# EAGLE design snopf (EAGLE 9.6.1)
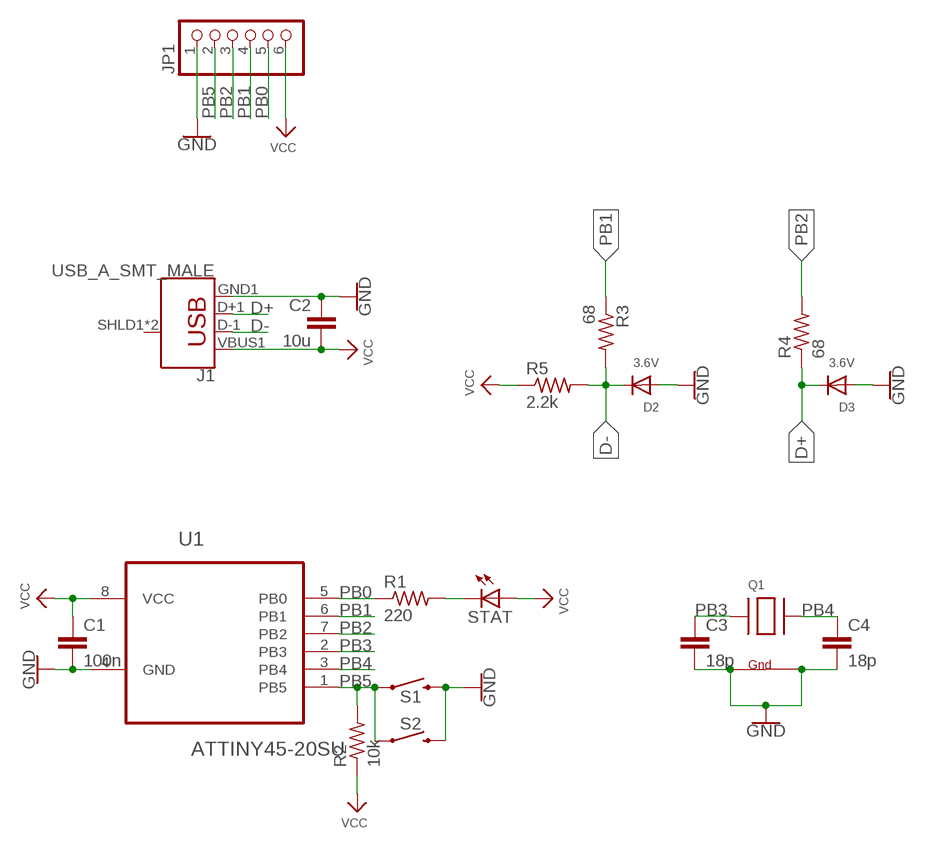
[diagram p0: schematic, sheet 1]

## Parts
C1  100n  C-EUC0603  [C0603]
C2  10u  C-EUC0603  [C0603]
C3  18p  C-EUC0603  [C0603]
C4  18p  C-EUC0603  [C0603]
D2  3.6V  DIODESOD-123  [SOD-123]
D3  3.6V  DIODESOD-123  [SOD-123]
J1  USB_A_SMT_MALE  [USB-A-SMT-MALE]
JP1  PINHD-1X6CLEAN  [1X06-CLEAN]
Q1  XTAL-4-3225  [NX3225]
R1  220  R-US_R0603  [R0603]
R2  10k  R-US_R0603  [R0603]
R3  68  R-US_R0603  [R0603]
R4  68  R-US_R0603  [R0603]
R5  2.2k  R-US_R0603  [R0603]
S1  MOMENTARY-SWITCH-SPST-SMD-12MM  [TACTILE_SWITCH_SMD_12MM]
S2  MOMENTARY-SWITCH-SPST-SMD-5.2-REDUNDANT  [TACTILE_SWITCH_SMD_5.2MM]
STAT  LEDCHIPLED_0603  [CHIPLED_0603]
U1  ATTINY45-20SU  [SOIC127P798X216-8N]

## Nets
D+: D3.C J1.D+1(D+) R4.1
D-: D2.C J1.D-1(D-) R3.2 R5.2
GND: C1.2 C2.1 C3.2 C4.2 D2.A D3.A J1.GND1(GND) JP1.1 Q1.2(G2) Q1.4(G1) S1.3 S2.3 S2.4 U1.4(GND)
N$2: R1.2 STAT.C
PB0: JP1.5 R1.1 U1.5(PB0)
PB1: JP1.4 R3.1 U1.6(PB1)
PB2: JP1.3 R4.2 U1.7(PB2)
PB3: C3.1 Q1.1(X1) U1.2(PB3)
PB4: C4.1 Q1.3(X2) U1.3(PB4)
PB5: JP1.2 R2.2 S1.1 S2.1 S2.2 U1.1(PB5)
VCC: C1.1 C2.2 J1.VBUS1(VBUS) JP1.6 R2.1 R5.1 STAT.A U1.8(VCC)
Unconnected: J1.SHLD1(SHIELD) J1.SHLD2(SHIELD)

## Library data of the parts
C1-C4 = resistor:C-EU: CAPACITOR, European symbol
D2 D3 = adafruit:DIODE: Diode SMADIODE - SMA Surface Mount Package 20V 1A Schottky Diode Digikey: 641-1014-6-ND DO-1N4148 - Through Hole Small Current Diode SOD-123 20V 1 A (.5mV Vf) Schottky Diode - Digikey: MBRX120TPMSCT-ND SOD-323 10V 570mA (.38mV Vf, 3ns) Schottky Diode - Digikey: ZLLS410CT-ND SOD-523 30V 30mA Schottky Diode (RB751S-40TE61) - Digikey: RB751S-40TE61CT-ND SOT23-R/W - SOT23 Package (R = Solder Paste/Reflow Ovens, W = Hand-Soldering) BAT54Film 40V 300mA - Digikey: 497-7162-1-ND
J1 = SparkFun-Connectors:USB_A: USB-A Connector Male and female variants, as well as PTH and SMT variants SparkFun Products: SparkFun XBee Explorer Dongle <https://www.sparkfun.com/products/11697> PTH Male SparkFun MicroView-USB Programmer <https://www.sparkfun.com/products/12924> SMT Male SparkFun USB Type A Female Breakout <https://www.sparkfun.com/products/12700> SMT Female; PROD_ID: CONN-11499
JP1 = adafruit:PINHD-1X6: PIN HEADER
Q1 = adafruit:XTAL-4: Classic 4-pin 3.2 x 2.5mm crystal
R1-R5 = resistor:R-US_: RESISTOR, American symbol
S1 = SparkFun-Switches:MOMENTARY-SWITCH-SPST: Momentary Switch (Pushbutton) - SPST Normally-open (NO) SPST momentary switches (buttons, pushbuttons). Variants PTH-12MM - 12mm square, through-hole Momentary Pushbutton Switch - 12mm Square <https://www.sparkfun.com/products/9190> (COM-09190) PTH-6.0MM, PTH-6.0MM-KIT - 6.0mm square, through-hole Mini Pushbutton Switch <https://www.sparkfun.com/products/97> (COM-00097) KIT package intended for soldering kit's - only one side of pads' copper is exposed. PTH-RIGHT-ANGLE-KIT - Right-angle, through-hole Right Angle Tactile Button <https://www.sparkfun.com/products/10791> - Used on SparkFun BigTime Watch Kit <https://www.sparkfun.com/products/11734> SMD-12MM - 12mm square, surface-mount Tactile Button - SMD (12mm) <https://www.sparkfun.com/products/12993> (COM-12993) Used on SparkFun PicoBoard <https://www.sparkfun.com/products/11888> SMD-4.5MM - 4.5mm Square Trackball Switch Used on SparkFun Blackberry Trackballer Breakout <https://www.sparkfun.com/products/13169> SMD-4.6MMX2.8MM - 4.60mm x 2.80mm, surface mount Used on SparkFun SAMD21 Mini Breakout <https://www.sparkfun.com/products/13664> SMD-5.2MM, SMD-5.2-REDUNDANT - 5.2mm square, surface-mount Mini Pushbutton Switch - SMD <https://www.sparkfun.com/products/8720> (COM-08720) Used on Arduino Pro Mini <https://www.sparkfun.com/products/11114> REDUNDANT package connects both switch circuits together SMD-6.0X3.5MM - 6.0 x 3.5mm, surface mount Momentary Reset Switch SMD <https://www.sparkfun.com/products/8229> (COM-08229) SMD-6.2MM-TALL - 6.2mm square, surface mount Tactile Button - SMD (6mm) <https://www.sparkfun.com/products/12992> Used on SparkFun Digital Sandbox <https://www.sparkfun.com/products/12651> SMD-RIGHT-ANGLE - Right-angle, surface mount Used on SparkFun Block for Intel® Edison - Arduino <https://www.sparkfun.com/products/13036>; PROD_ID: SWCH-11967; SF_SKU: COM-12993
S2 = SparkFun-Switches:MOMENTARY-SWITCH-SPST: Momentary Switch (Pushbutton) - SPST Normally-open (NO) SPST momentary switches (buttons, pushbuttons). Variants PTH-12MM - 12mm square, through-hole Momentary Pushbutton Switch - 12mm Square <https://www.sparkfun.com/products/9190> (COM-09190) PTH-6.0MM, PTH-6.0MM-KIT - 6.0mm square, through-hole Mini Pushbutton Switch <https://www.sparkfun.com/products/97> (COM-00097) KIT package intended for soldering kit's - only one side of pads' copper is exposed. PTH-RIGHT-ANGLE-KIT - Right-angle, through-hole Right Angle Tactile Button <https://www.sparkfun.com/products/10791> - Used on SparkFun BigTime Watch Kit <https://www.sparkfun.com/products/11734> SMD-12MM - 12mm square, surface-mount Tactile Button - SMD (12mm) <https://www.sparkfun.com/products/12993> (COM-12993) Used on SparkFun PicoBoard <https://www.sparkfun.com/products/11888> SMD-4.5MM - 4.5mm Square Trackball Switch Used on SparkFun Blackberry Trackballer Breakout <https://www.sparkfun.com/products/13169> SMD-4.6MMX2.8MM - 4.60mm x 2.80mm, surface mount Used on SparkFun SAMD21 Mini Breakout <https://www.sparkfun.com/products/13664> SMD-5.2MM, SMD-5.2-REDUNDANT - 5.2mm square, surface-mount Mini Pushbutton Switch - SMD <https://www.sparkfun.com/products/8720> (COM-08720) Used on Arduino Pro Mini <https://www.sparkfun.com/products/11114> REDUNDANT package connects both switch circuits together SMD-6.0X3.5MM - 6.0 x 3.5mm, surface mount Momentary Reset Switch SMD <https://www.sparkfun.com/products/8229> (COM-08229) SMD-6.2MM-TALL - 6.2mm square, surface mount Tactile Button - SMD (6mm) <https://www.sparkfun.com/products/12992> Used on SparkFun Digital Sandbox <https://www.sparkfun.com/products/12651> SMD-RIGHT-ANGLE - Right-angle, surface mount Used on SparkFun Block for Intel® Edison - Arduino <https://www.sparkfun.com/products/13036>; PROD_ID: SWCH-08247; SF_SKU: COM-08720
STAT = adafruit:LED: LED OSRAM: - CHIPLED LG R971, LG N971, LY N971, LG Q971, LY Q971, LO R971, LY R971 LH N974, LH R974 LS Q976, LO Q976, LY Q976 LO Q996 - Hyper CHIPLED LW Q18S LB Q993, LB Q99A, LB R99A - SideLED LS A670, LO A670, LY A670, LG A670, LP A670 LB A673, LV A673, LT A673, LW A673 LH A674 LY A675 LS A676, LA A676, LO A676, LY A676, LW A676 LS A679, LY A679, LG A679 - Hyper Micro SIDELED® LS Y876, LA Y876, LO Y876, LY Y876 LT Y87S - SmartLED LW L88C, LW L88S LB L89C, LB L89S, LG L890 LS L89K, LO L89K, LY L89K LS L896, LA L896, LO L896, LY L896 - TOPLED LS T670, LO T670, LY T670, LG T670, LP T670 LSG T670, LSP T670, LSY T670, LOP T670, LYG T670 LG T671, LOG T671, LSG T671 LB T673, LV T673, LT T673, LW T673 LH T674 LS T676, LA T676, LO T676, LY T676, LB T676, LH T676, LSB T676, LW T676 LB T67C, LV T67C, LT T67C, LS T67K, LO T67K, LY T67K, LW E67C LS E67B, LA E67B, LO E67B, LY E67B, LB E67C, LV E67C, LT E67C LW T67C LS T679, LY T679, LG T679 LS T770, LO T770, LY T770, LG T770, LP T770 LB T773, LV T773, LT T773, LW T773 LH T774 LS E675, LA E675, LY E675, LS T675 LS T776, LA T776, LO T776, LY T776, LB T776 LHGB T686 LT T68C, LB T68C - Hyper Mini TOPLED® LB M676 - Mini TOPLED Santana® LG M470 LS M47K, LO M47K, LY M47K Source: http://www.osram.convergy.de/
U1 = ATTINY45-20SU:ATTINY45-20SU: 8-bit Microcontroller with 4 Bytes In-System Programmable Flash; AVAILABILITY: Unavailable; DESCRIPTION: ATtiny Series 20 MHz 4 KB Flash 256 B SRAM 8-Bit Microcontroller - SOIC-8; MF: Microchip; MP: ATTINY45-20SU; PACKAGE: SOIC-8 Microchip; PRICE: None

## Board
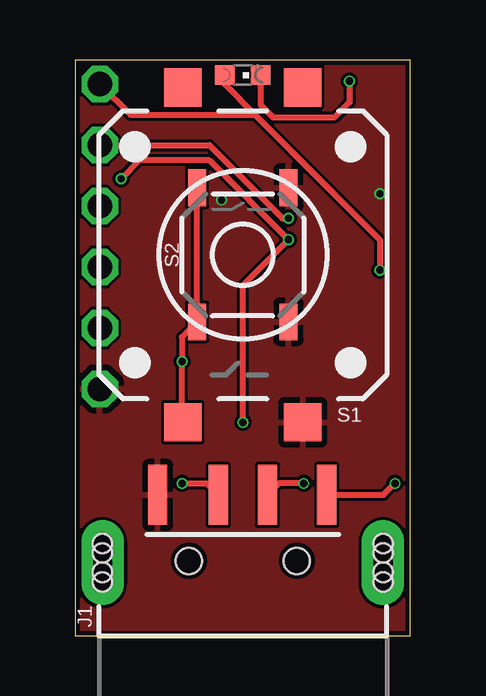
[diagram p1: board, top side]
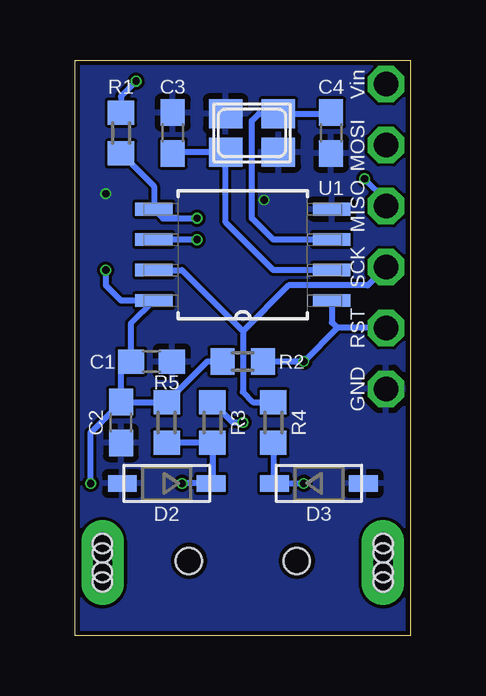
[diagram p2: board, bottom side, seen from below]

Size 13.97 x 23.99 mm. Coordinates in mm from the lower left corner, seen from the top.
Outline: 0,0 13.97,0 13.97,23.99 0,23.99 0,0
Copper layers (1*16): Top 0.035mm / dielectric 1.5mm / Bottom 0.035mm
Design rules "jlcpcb": minimum track width 3.5mil, minimum drill 0.2mm, track to track 5mil, track to pad 5mil, pad to pad 5mil, via to via 5mil, smd to smd 5mil, copper to edge 0.2mm, drill to drill 0.4mm, minimum pad ring 3mil, minimum via ring 3mil, stop-mask expansion 4mil, vias tented up to drill 35mil, thermal gap 10mil

### Footprints (pad centres in the part's own frame; a part is rotated, then mirrored left to right if it is on the bottom)
C0603 = smd 1.1 x 1: 1 -0.85,0; 2 0.85,0
SOD-123 = smd 1.2 x 0.7: A 1.85,0; C -1.85,0
USB-A-SMT-MALE = smd 2.5 x 0.8: D+1 10.95,1.027; D-1 10.95,-1.027; GND1 10.95,3.551; VBUS1 10.95,-3.5 | drill 0.8 pad 1.778 long: SHLD1 8.13,-5.85; SHLD2 8.13,5.85 | hole 1.1: 8.2,2.25; 8.2,-2.25 | hole 0.8: 8.53,-5.85; 8.93,-5.85; 7.73,-5.85; 7.33,-5.85; 8.53,5.85; 8.93,5.85; 7.73,5.85; 7.33,5.85
1X06-CLEAN = drill 1.016 octagon: 1 -6.35,0; 2 -3.81,0; 3 -1.27,0; 4 1.27,0; 5 3.81,0; 6 6.35,0
NX3225 = smd 1.4 x 1.2: 1 -1.1,-0.8; 2 1.1,-0.8; 3 1.1,0.8; 4 -1.1,0.8
R0603 = smd 1 x 1.1: 1 -0.85,0; 2 0.85,0
TACTILE_SWITCH_SMD_12MM = smd 1.6 x 1.55: 1 6.975,-2.5; 2 -6.975,-2.5; 3 6.975,2.5; 4 -6.975,2.5
TACTILE_SWITCH_SMD_5.2MM = smd 1.524 x 0.762: 1 -2.794,1.905; 2 2.794,1.905; 3 -2.794,-1.905; 4 2.794,-1.905
CHIPLED_0603 = smd 0.8 x 0.8: A 0,-0.75; C 0,0.75
SOIC127P798X216-8N = smd 1.549 x 0.533: 1 -3.708,1.905; 2 -3.708,0.635; 3 -3.708,-0.635; 4 -3.708,-1.905; 5 3.708,-1.905; 6 3.708,-0.635; 7 3.708,0.635; 8 3.708,1.905

### Placement (x,y rotation side)
C1  10.79,11.43 0 bottom
C2  12.06,8.89 90 bottom
C3  9.91,20.95 90 bottom
C4  3.3,20.95 270 bottom
D2  10.16,6.35 180 bottom
D3  3.81,6.35 0 bottom
J1  6.99,-5.08 90 top
JP1  1.02,16.64 90 top
Q1  6.6,20.95 0 bottom
R1  12.06,20.95 90 bottom
R2  6.99,11.43 0 bottom
R3  8.26,8.89 270 bottom
R4  5.71,8.89 90 bottom
R5  10.16,8.89 270 bottom
S1  6.99,15.88 270 top
S2  6.99,15.88 90 top
STAT  6.99,23.37 270 top
U1  6.99,15.88 180 bottom

### Tracks (layer width: path | path; a pad name or v marks a point on that pad's centre or on a via)
D+  (via drill 0.3)
  Top 0.254: v4.45,6.35 5.48,6.35 J1.D+1
  Bottom 0.254: R4.1 5.71,6.41 D3.C v4.45,6.35
D-  (via drill 0.3)
  Top 0.254: v9.53,6.35 8.49,6.35 J1.D-1
  Bottom 0.254: v9.53,6.35 D2.C 8.26,6.41 R3.2 R5.2
GND  (via drill 0.3)
  other vias: 12.7,18.41 6.1,18.16
  pour Top: 0,24 0,0 13.97,0 13.97,24
  pour Bottom: 0,0 0,24 13.97,24 13.97,0
N$2  (via drill 0.3)
  Top 0.254: v11.43,23.11 11.43,22.23 10.79,21.59 8.26,21.59 7.73,22.11 STAT.C
  Bottom 0.254: R1.2 12.06,22.48 v11.43,23.11
PB0  (via drill 0.3)
  Top 0.254: JP1.5 5.59,20.45 8.64,17.4 v8.89,17.4
  Bottom 0.254: R1.1 10.69,18.73 U1.5 10.31,17.4 v8.89,17.4
PB1  (via drill 0.3)
  Top 0.254: v1.91,19.05 2.67,19.81 5.59,19.81 v8.89,16.51 6.99,14.61 v6.99,8.89
  Bottom 0.254: JP1.4 1.02,18.16 v1.91,19.05 | v8.89,16.51 U1.6 | R3.1 7.4,8.89 v6.99,8.89
PB2
  Bottom 0.254: JP1.3 1.78,14.61 5.08,14.61 6.99,12.7 | 6.99,12.7 6.99,10.16 6.57,9.74 R4.2 | U1.7 9.53,15.24 6.99,12.7
PB3
  Bottom 0.254: C3.1 9.86,20.16 Q1.1 7.7,17.23 5.71,15.24 U1.2
PB4
  Bottom 0.254: C4.1 3.35,21.75 Q1.3 6.31,21.75 6.6,21.46 6.6,17.4 5.71,16.51 U1.3
PB5  (via drill 0.3)
  Top 0.254: S1.1 4.45,8.94 v4.45,11.43 4.45,12.45 S2.1 S2.2
  Bottom 0.254: JP1.2 3.05,12.83 | 3.05,12.83 v4.45,11.43 R2.2 | U1.1 3.28,13.06 3.05,12.83
VCC  (via drill 0.3)
  Top 0.254: J1.VBUS1 12.86,5.87 v13.34,6.35 | STAT.A 6.24,22.98 7.49,21.72 | v12.7,15.24 12.7,16.51 7.49,21.72 | JP1.6 2.3,21.7 7.48,21.7 7.49,21.72
  Bottom 0.254: v13.34,6.35 13.34,8.47 C2.2 | C2.2 R5.1 8.47,11.43 R2.1 | C2.2 12.06,11.01 C1.1 11.64,13.02 U1.8 12.06,13.97 12.7,14.61 v12.7,15.24

### Text on the board
bNames: Vin | MOSI | MISO | SCK | RST | GND